# EasyEDA schematic PI_SCH_HDMI.json
TITLE: DRONE_PI_SHIELD_HDMI; REV: 3.0; Date: 17-11-2023; Sheet: 1/1; Company: QUB
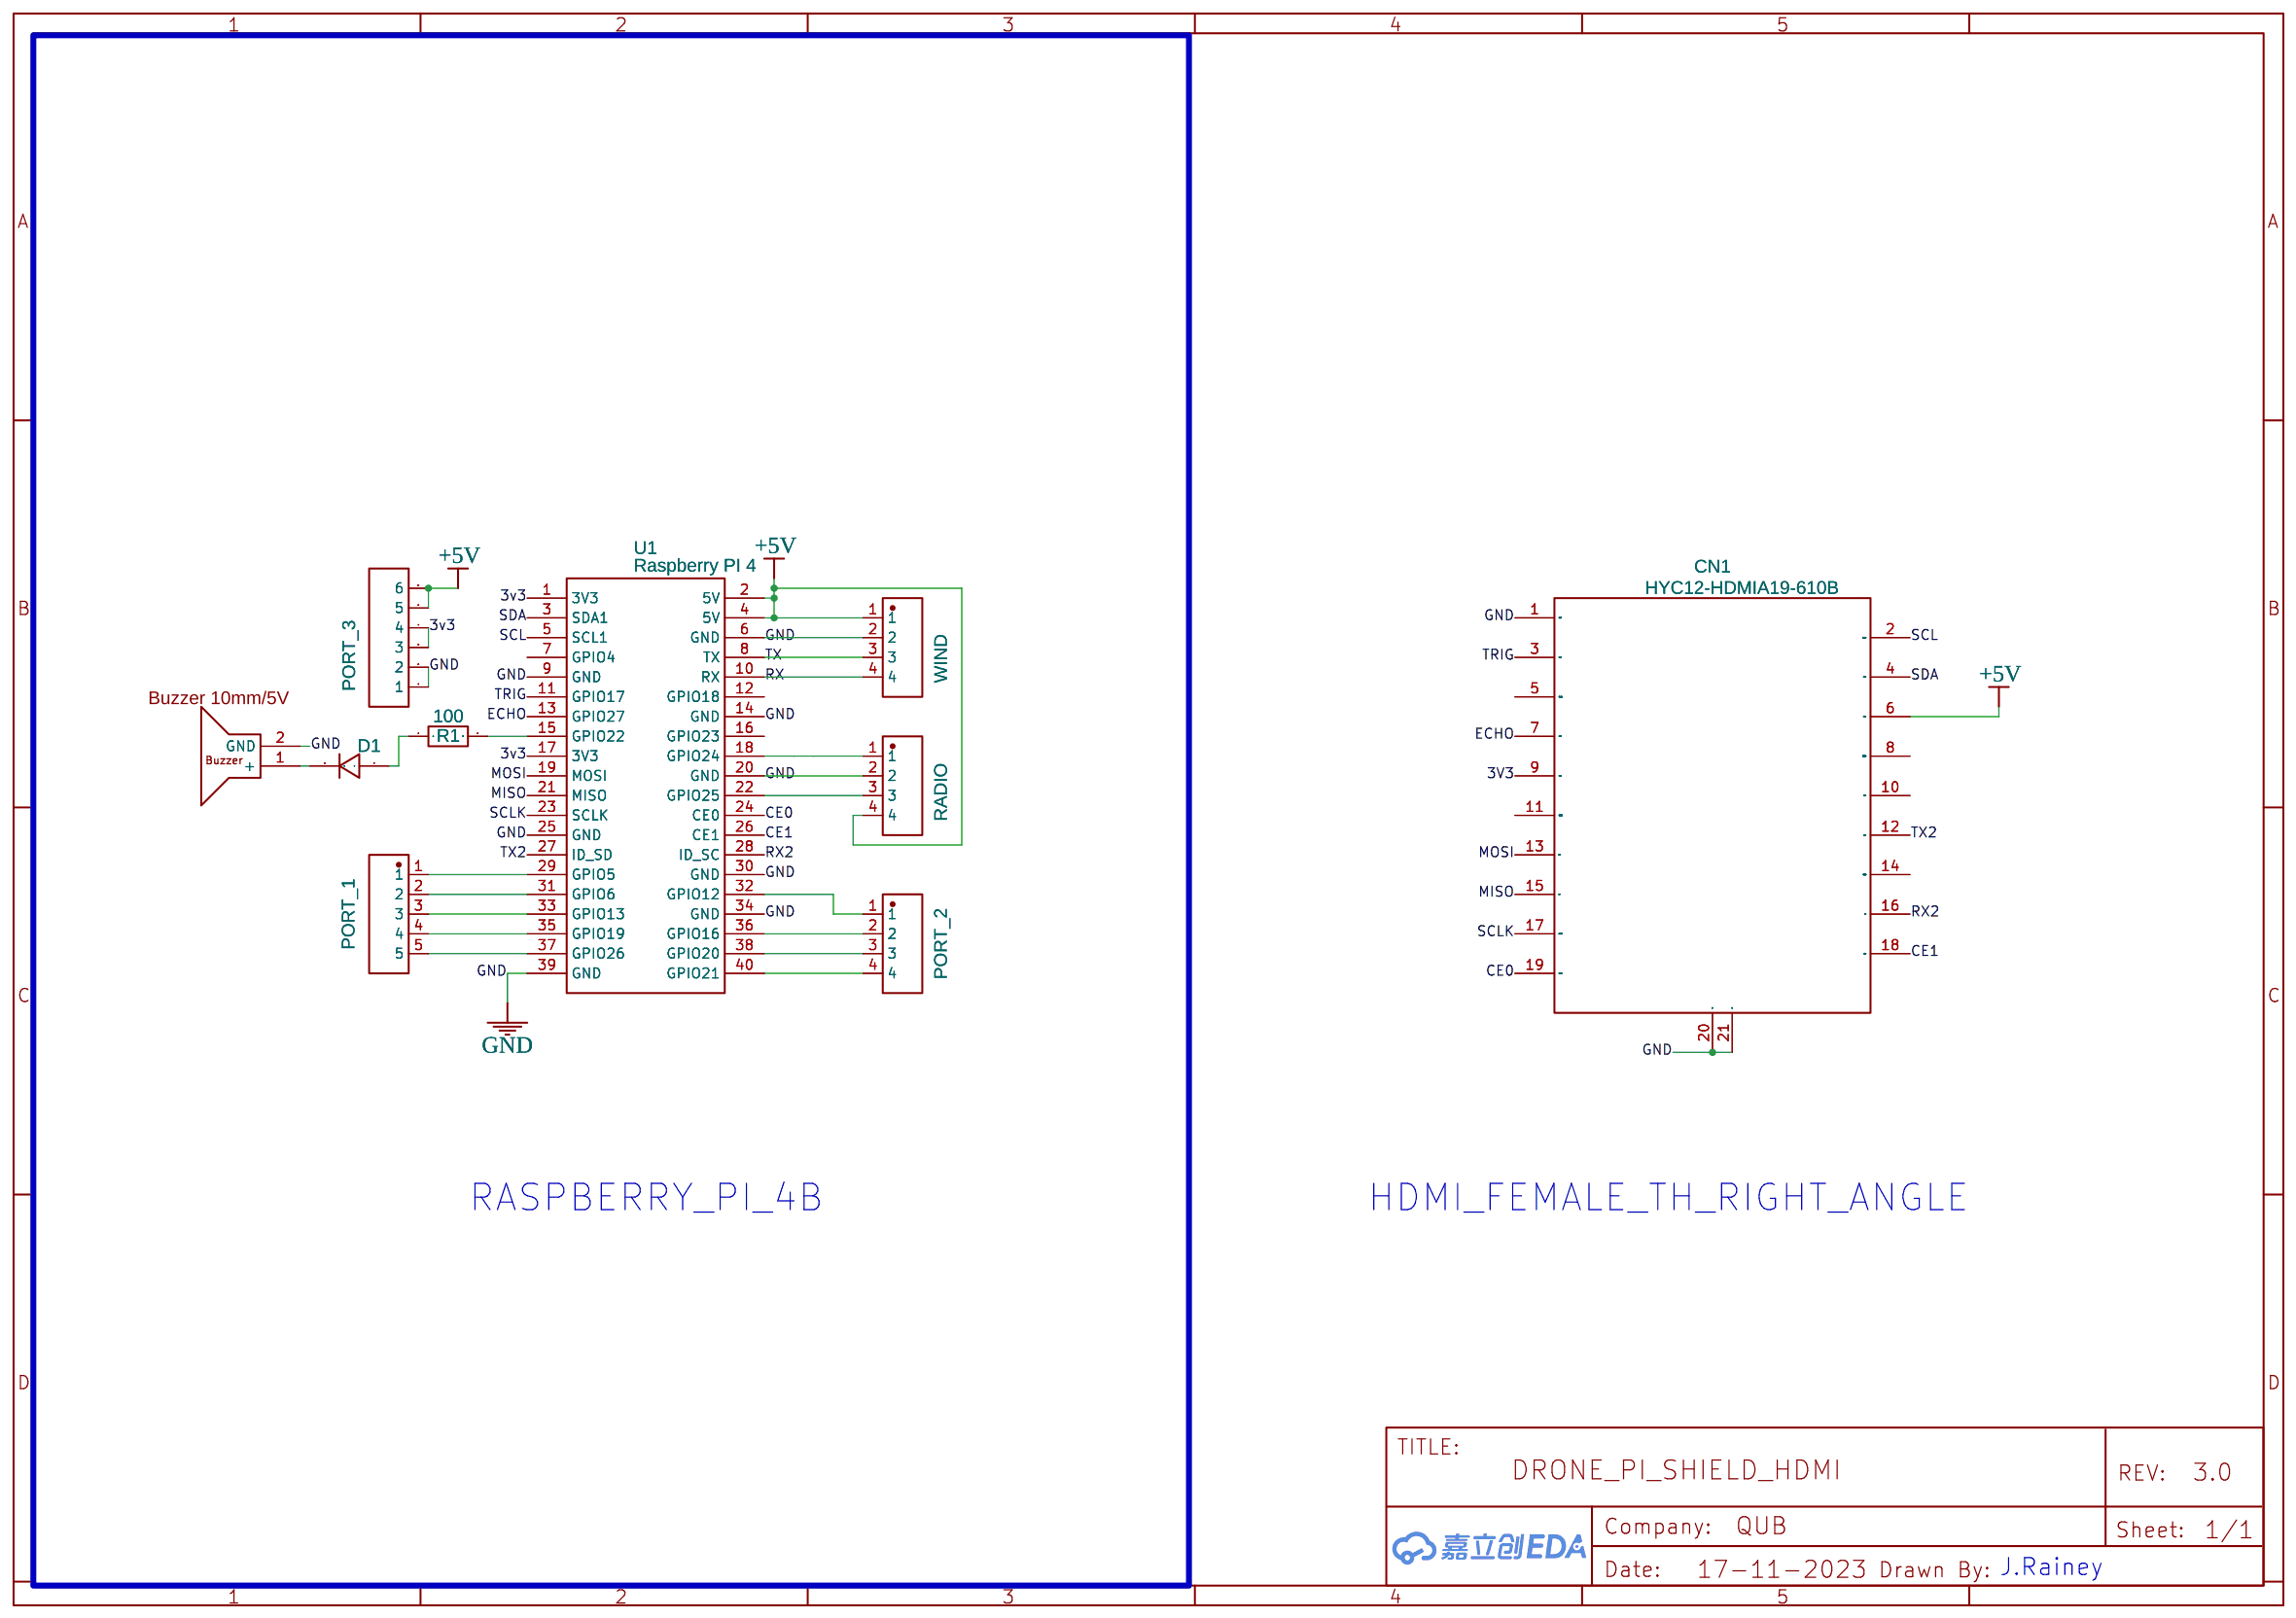
[diagram p0: schematic sheet]

## Parts
BUZZER1  Buzzer 10mm/5V  [BUZZER 10MM [PCB]]
CN1  HYC12-HDMIA19-610B  [HDMI-TH_HYC12-HDMIA19-61]
D1  1N4448  [DO-35_BD2.0-L4.2-P8.20-D0.5-R-RD]
PORT_1  PZ254V-11-05P  [HDR-TH_5P-P2.54-V-M]
PORT_2  PZ254V-11-04P  [HDR-TH_4P-P2.54-V-M]
PORT_3  HEADER-MALE-2.54_1X6  [HDR-TH_6P-P2.54-V]
R1  100  [R_AXIAL-0.4]
RADIO  PZ254V-11-04P  [HDR-TH_4P-P2.54-V-M]
U1  Raspberry PI 4  [RASPBERRY PI 4]
WIND  PZ254V-11-04P  [HDR-TH_4P-P2.54-V-M]

## Library data of the parts
BUZZER1 = Buzzer 10mm/5V: Supplier: SHIVRAM; Supplier Part: BUZZER; Manufacturer: SHIVRAM; Manufacturer Part: BUZZER; Contributor: Scikraft; Package Display: No
CN1 = HYC12-HDMIA19-610B: Supplier: LCSC; Supplier Part: C711354; Manufacturer: 华宇创; Contributor: LCSC; JLCPCB Part Class: Extended Part
D1 = 1N4448: Contributor: 官方封装库; Supplier: LCSC; Manufacturer: ST(先科); Supplier Part: C54037; JLCPCB Part Class: Extended Part
PORT_1 = PZ254V-11-05P: Supplier: LCSC; Supplier Part: C492404; Manufacturer: XFCN; Contributor: muratsozen; JLCPCB Part Class: Extended Part
PORT_2 RADIO WIND = PZ254V-11-04P: Supplier: LCSC; Supplier Part: C492403; Manufacturer: XFCN; Contributor: vatsal patel; JLCPCB Part Class: Extended Part
PORT_3 = HEADER-MALE-2.54_1X6: Supplier: LCSC; Manufacturer: BOOMELE; Manufacturer Part: Header-Male-2.54_1x6; Supplier Part: C37208
R1 = R_AXIAL-0.4_EU: Contributor: LCEDA_Lib
U1 = Raspberry PI 4: Contributor: RachelTX; subpart_no: 2

## Nets
3v3: PORT_3.3 PORT_3.4 U1.1(3V3) U1.17(3V3)
3V3: CN1.9(TMDS Data 0-)
+5V: CN1.6(TMDS Data 1-) PORT_3.5 PORT_3.6 RADIO.4 U1.2(5V) U1.4(5V) WIND.1
GND: BUZZER1.2(GND) CN1.1(TMDS Data 2+) CN1.20(EH) CN1.21(EH) PORT_3.1 PORT_3.2 RADIO.2 U1.6(GND) U1.9(GND) U1.14(GND) U1.20(GND) U1.25(GND) U1.30(GND) U1.34(GND) U1.39(GND) WIND.2
CE0: CN1.19(Hot Plug Detect) U1.24(CE0)
CE1: CN1.18(+5V Power) U1.26(CE1)
ECHO: CN1.7(TMDS Data 0+) U1.13(GPIO27)
MISO: CN1.15(SCL) U1.21(MISO)
MOSI: CN1.13(CEC) U1.19(MOSI)
RX: U1.10(RX) WIND.4
RX2: CN1.16(SDA) U1.28(ID_SC)
SCL: CN1.2(TMDS Data 2 Shield) U1.5(SCL1)
SCLK: CN1.17(DDC/CEC Ground) U1.23(SCLK)
SDA: CN1.4(TMDS Data 1+) U1.3(SDA1)
TRIG: CN1.3(TMDS Data 2-) U1.11(GPIO17)
TX: U1.8(TX) WIND.3
TX2: CN1.12(TMDS Clock-) U1.27(ID_SD)
Net-(BUZZER1-1): BUZZER1.1(+) D1.2(K)
Net-(D1-1): D1.1(A) R1.1
Net-(PORT_1-1): PORT_1.1 U1.29(GPIO5)
Net-(PORT_1-2): PORT_1.2 U1.31(GPIO6)
Net-(PORT_1-3): PORT_1.3 U1.33(GPIO13)
Net-(PORT_1-4): PORT_1.4 U1.35(GPIO19)
Net-(PORT_1-5): PORT_1.5 U1.37(GPIO26)
Net-(PORT_2-1): PORT_2.1 U1.32(GPIO12)
Net-(PORT_2-2): PORT_2.2 U1.36(GPIO16)
Net-(PORT_2-3): PORT_2.3 U1.38(GPIO20)
Net-(PORT_2-4): PORT_2.4 U1.40(GPIO21)
Net-(R1-2): R1.2 U1.15(GPIO22)
Net-(RADIO-1): RADIO.1 U1.18(GPIO24)
Net-(RADIO-3): RADIO.3 U1.22(GPIO25)

Not connected (* = marked no-connect by the designer): CN1 5(TMDS Data 1 Shield) 8(TMDS Data 0 Shield) 10(TMDS Clock+) 11(TMDS Clock Shield) 14(Reserved (N.C.)); U1 7(GPIO4) 12(GPIO18) 16(GPIO23)

## Notes on the sheet
- RASPBERRY_PI_4B
- HDMI_FEMALE_TH_RIGHT_ANGLE
- J.Rainey
